# Altium schematic sheet MCU.SchDoc
size A4
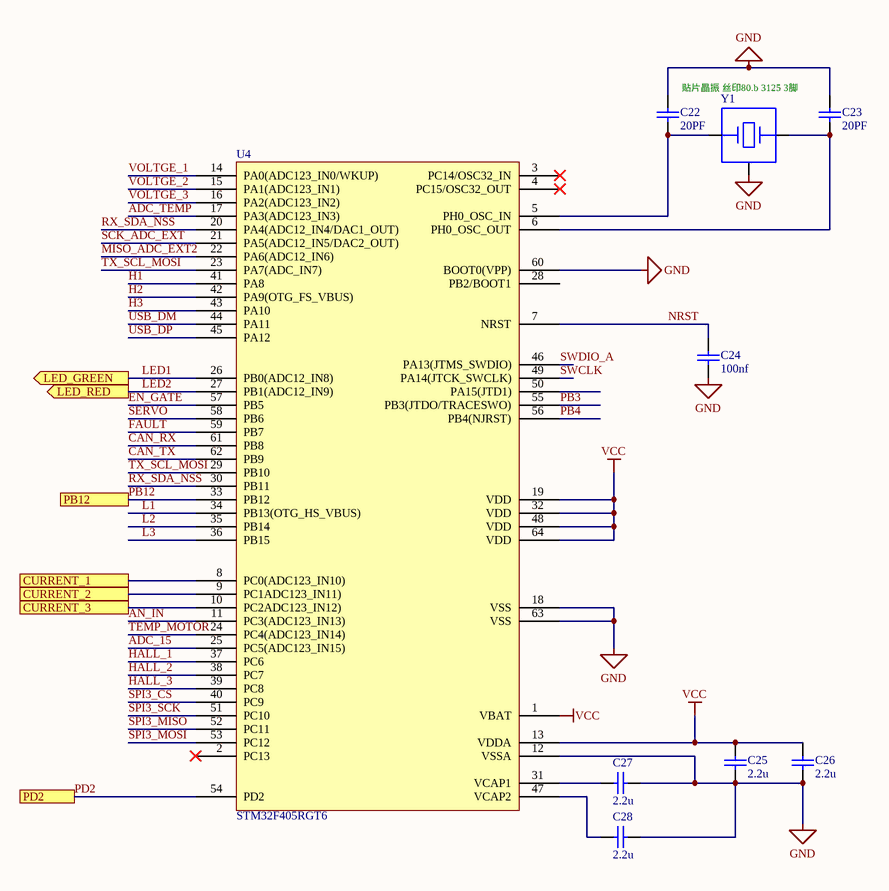
[diagram p0: MCU.SchDoc]

## Parts
C22  20PF  [0603-1]
C23  20PF  [0603-1]
C24  100nf  [0603-1]
C25  2.2u  [0603-1]
C26  2.2u  [0603-1]
C27  2.2u  [0603-1]
C28  2.2u  [0603-1]
U4  STM32F405RGT6  [LQFP64]
Y1  贴片晶振 丝印80.b 3125 3脚  [SMD-3]

## Ports
CURRENT_1, CURRENT_2, CURRENT_3, LED_GREEN (out), LED_RED (out), PB12, PD2

## Nets
GND: C22.1 C23.1 C24.1 C25.1 C26.1 C27.1 C28.1 U4.12(VSSA) U4.18(VSS) U4.60(BOOT0(VPP)) U4.63(VSS) Y1.2
VCC: C25.2 C26.2 U4.1(VBAT) U4.13(VDDA) U4.19(VDD) U4.32(VDD) U4.48(VDD) U4.64(VDD)
ADC_15: U4.25(PC5(ADC123_IN15))
ADC_TEMP: U4.17(PA3(ADC123_IN3))
AN_IN: U4.11(PC3(ADC123_IN13))
CAN_RX: U4.61(PB8)
CAN_TX: U4.62(PB9)
CURRENT_1: U4.8(PC0(ADC123_IN10)) ; port CURRENT_1
CURRENT_2: U4.9(PC1ADC123_IN11)) ; port CURRENT_2
CURRENT_3: U4.10(PC2ADC123_IN12)) ; port CURRENT_3
EN_GATE: U4.57(PB5)
FAULT: U4.59(PB7)
H1: U4.41(PA8)
H2: U4.42(PA9(OTG_FS_VBUS))
H3: U4.43(PA10)
HALL_1: U4.37(PC6)
HALL_2: U4.38(PC7)
HALL_3: U4.39(PC8)
L1: U4.34(PB13(OTG_HS_VBUS))
L2: U4.35(PB14)
L3: U4.36(PB15)
LED1: U4.26(PB0(ADC12_IN8)) ; port LED_GREEN
LED2: U4.27(PB1(ADC12_IN9)) ; port LED_RED
MISO_ADC_EXT2: U4.22(PA6(ADC12_IN6))
NRST: C24.2 U4.7(NRST)
PB3: U4.55(PB3(JTDO/TRACESWO))
PB4: U4.56(PB4(NJRST))
PB12: U4.33(PB12) ; port PB12
PD2: U4.54(PD2) ; port PD2
RX_SDA_NSS: U4.20(PA4(ADC12_IN4/DAC1_OUT)) U4.30(PB11)
SCK_ADC_EXT: U4.21(PA5(ADC12_IN5/DAC2_OUT))
SERVO: U4.58(PB6)
SPI3_CS: U4.40(PC9)
SPI3_MISO: U4.52(PC11)
SPI3_MOSI: U4.53(PC12)
SPI3_SCK: U4.51(PC10)
SWCLK: U4.49(PA14(JTCK_SWCLK))
SWDIO_A: U4.46(PA13(JTMS_SWDIO))
TEMP_MOTOR: U4.24(PC4(ADC123_IN14))
TX_SCL_MOSI: U4.23(PA7(ADC_IN7)) U4.29(PB10)
USB_DM: U4.44(PA11)
USB_DP: U4.45(PA12)
VOLTGE_1: U4.14(PA0(ADC123_IN0/WKUP))
VOLTGE_2: U4.15(PA1(ADC123_IN1))
VOLTGE_3: U4.16(PA2(ADC123_IN2))
NetC22_2: C22.2 U4.5(PH0_OSC_IN) Y1.3
NetC23_2: C23.2 U4.6(PH0_OSC_OUT) Y1.1
NetC27_2: C27.2 U4.31(VCAP1)
NetC28_2: C28.2 U4.47(VCAP2)

Not connected (* = marked no-connect by the designer): U4 2(PC13)* 3(PC14/OSC32_IN)* 4(PC15/OSC32_OUT)* 28(PB2/BOOT1) 50(PA15(JTD1))

## Library data of the parts
C22-C28 = CAP: Capacitor; Value: 104; Published: 8-Jun-2000; LatestRevisionDate: 17-Jul-2002; LatestRevisionNote: Re-released for DXP Platform.; PackageReference: RAD-0.3; Publisher: Altium Limited
Y1 = CRYSTAL_1: Crystal